# Altium project PCB_tesis.PrjPcb (part 2 of 2)

## Sheet Banks.SchDoc
size A4; SheetNumber: 3; SheetTotal: 5
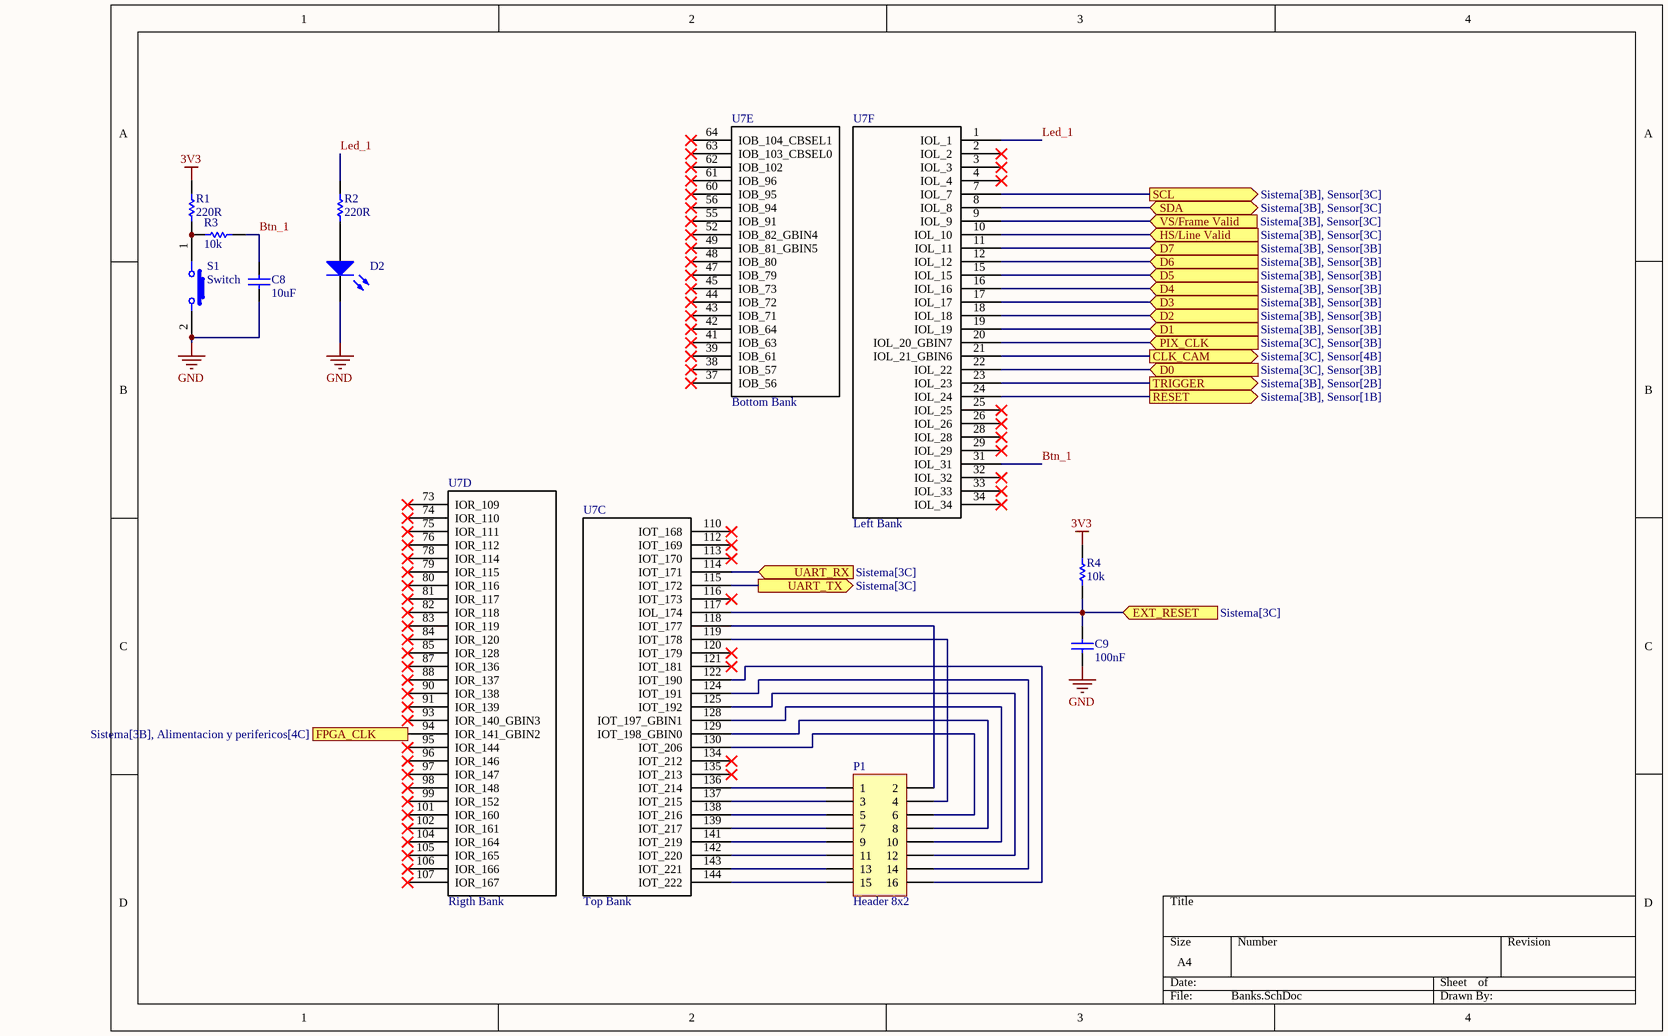
[diagram p3: Banks.SchDoc]

### Parts
C8  10uF  [C_1206_3216_A]
C9  100nF  [C_0805_2013_b]
D2  GREEN  [D_LED_0805_2013]  (value not drawn)
P1  Header 8x2  [P_HDR2X8_3D]
R1  220R  [R_0805_2012_a]
R2  220R  [R_0805_2012_a]
R3  10k  [R_0805_2012_a]
R4  10k  [R_0805_2012_a]
S1  Switch  [S_SMD_SPST-NO]
U7  Top Bank  [U_TQFP-144]  (parts C,D,E,F of 9)

### Ports
CLK_CAM (out, see Sistema[3C], Sensor[4B]), D0 (in, see Sistema[3C], Sensor[3B]), D1 (in, see Sistema[3B], Sensor[3B]), D2 (in, see Sistema[3B], Sensor[3B]), D3 (in, see Sistema[3B], Sensor[3B]), D4 (in, see Sistema[3B], Sensor[3B]), D5 (in, see Sistema[3B], Sensor[3B]), D6 (in, see Sistema[3B], Sensor[3B]), D7 (in, see Sistema[3B], Sensor[3B]), EXT_RESET (in, see Sistema[3C]), FPGA_CLK (in, see Sistema[3B], Alimentacion y perifericos[4C]), HS/Line Valid (in, see Sistema[3B], Sensor[3C]), PIX_CLK (in, see Sistema[3C], Sensor[3B]), RESET (out, see Sistema[3B], Sensor[1B]), SCL (out, see Sistema[3B], Sensor[3C]), SDA (bidir, see Sistema[3B], Sensor[3C]), TRIGGER (out, see Sistema[3B], Sensor[2B]), UART_RX (in, see Sistema[3C]), UART_TX (out, see Sistema[3C]), VS/Frame Valid (in, see Sistema[3B], Sensor[3C])

### Nets
3V3: R1.2 R4.2
GND: C8.1 C9.1 D2.1(K) S1.2
Btn_1: C8.2 R3.2 U7.31(IOL_31)
Led_1: R2.2 U7.1(IOL_1)
NetC9_2: C9.2 R4.1 U7.117(IOL_174) ; port EXT_RESET
NetD2_2: D2.2(A) R2.1
NetP1_1: P1.1 U7.136(IOT_214)
NetP1_2: P1.2 U7.118(IOT_177)
NetP1_3: P1.3 U7.137(IOT_215)
NetP1_4: P1.4 U7.119(IOT_178)
NetP1_5: P1.5 U7.138(IOT_216)
NetP1_6: P1.6 U7.130(IOT_206)
NetP1_7: P1.7 U7.139(IOT_217)
NetP1_8: P1.8 U7.129(IOT_198_GBIN0)
NetP1_9: P1.9 U7.141(IOT_219)
NetP1_10: P1.10 U7.128(IOT_197_GBIN1)
NetP1_11: P1.11 U7.142(IOT_220)
NetP1_12: P1.12 U7.125(IOT_192)
NetP1_13: P1.13 U7.143(IOT_221)
NetP1_14: P1.14 U7.124(IOT_191)
NetP1_15: P1.15 U7.144(IOT_222)
NetP1_16: P1.16 U7.122(IOT_190)
NetP3_A8: U7.115(IOT_172) ; port UART_TX
NetP3_A9: U7.114(IOT_171) ; port UART_RX
NetR1_1: R1.1 R3.1 S1.1
NetR11_1: U7.94(IOR_141_GBIN2) ; port FPGA_CLK
NetU7_7: U7.7(IOL_7) ; port SCL
NetU7_8: U7.8(IOL_8) ; port SDA
NetU7_9: U7.9(IOL_9) ; port VS/Frame Valid
NetU7_10: U7.10(IOL_10) ; port HS/Line Valid
NetU7_11: U7.11(IOL_11) ; port D7
NetU7_12: U7.12(IOL_12) ; port D6
NetU7_15: U7.15(IOL_15) ; port D5
NetU7_16: U7.16(IOL_16) ; port D4
NetU7_17: U7.17(IOL_17) ; port D3
NetU7_18: U7.18(IOL_18) ; port D2
NetU7_19: U7.19(IOL_19) ; port D1
NetU7_20: U7.20(IOL_20_GBIN7) ; port PIX_CLK
NetU7_21: U7.21(IOL_21_GBIN6) ; port CLK_CAM
NetU7_22: U7.22(IOL_22) ; port D0
NetU7_23: U7.23(IOL_23) ; port TRIGGER
NetU7_24: U7.24(IOL_24) ; port RESET

Not connected (* = marked no-connect by the designer): U7 2(IOL_2)* 3(IOL_3)* 4(IOL_4)* 25(IOL_25)* 26(IOL_26)* 28(IOL_28)* 29(IOL_29)* 32(IOL_32)* 33(IOL_33)* 34(IOL_34)* 37(IOB_56)* 38(IOB_57)* 39(IOB_61)* 41(IOB_63)* 42(IOB_64)* 43(IOB_71)* 44(IOB_72)* 45(IOB_73)* 47(IOB_79)* 48(IOB_80)* 49(IOB_81_GBIN5)* 52(IOB_82_GBIN4)* 55(IOB_91)* 56(IOB_94)* 60(IOB_95)* 61(IOB_96)* 62(IOB_102)* 63(IOB_103_CBSEL0)* 64(IOB_104_CBSEL1)* 73(IOR_109)* 74(IOR_110)* 75(IOR_111)* 76(IOR_112)* 78(IOR_114)* 79(IOR_115)* 80(IOR_116)* 81(IOR_117)* 82(IOR_118)* 83(IOR_119)* 84(IOR_120)* 85(IOR_128)* 87(IOR_136)* 88(IOR_137)* 90(IOR_138)* 91(IOR_139)* 93(IOR_140_GBIN3)* 95(IOR_144)* 96(IOR_146)* 97(IOR_147)* 98(IOR_148)* 99(IOR_152)* 101(IOR_160)* 102(IOR_161)* 104(IOR_164)* 105(IOR_165)* 106(IOR_166)* 107(IOR_167)* 110(IOT_168)* 112(IOT_169)* 113(IOT_170)* 116(IOT_173)* 120(IOT_179)* 121(IOT_181)* 134(IOT_212)* 135(IOT_213)*

### Library data of the parts
C8 = C_10uF_25V_c: Capacitor SMD 1206; Manufacturer: Samsung; Manufacturer Part Number: CL31B106KAHNFNE; Tolerance: 10%; Voltage Rating: 25V; Dielectric: X7R; Mounting Technology: Surface Mount; Case/Package: 1206; Case Code (Metric): 3216; Case Code (Imperial): 1206; Min Operating Temperature: -55°C; Max Operating Temperature: 125°C; Packaging: Tape and Reel; Series: CL; Construction: Flat; Length: 3.2mm; Height: 1.6mm; Depth: 1.6mm; Radiation Hardening: No; Lead Free: Lead Free; RoHS Compliant: Yes; ComponentLink1URL: https://datasheet.ciiva.com/25795/cl31b106kahnfne-25795136.pdf?src-supplier=Digikey; ComponentLink1Description: https://datasheet.ciiva.com/25795/cl31b106kahnfne-25795136.pdf?src-supplier=Digikey; Supplier 1: Digikey; Supplier Part Number 1: 1276-3100-1-ND; RoHS: Yes; Category: Ceramic Capacitors; Stock 1: 466532; Pricing 1: 1=0,23, 10=0,149, 50=0,094, 100=0,0752, 500=0,0543, 1000=0,04804 (USD); Value: 10uF
C9 = C_100nF_50V_b: Capacitor SMD 0805; Manufacturer: Yageo; Manufacturer Part Number: CC0805KRX7R9BB104; Material: Ceramic; Tolerance: 10%; Dielectric: X7R; Voltage: 50V; Insulation Resistance: 100GR; Mounting Technology: Surface Mount; Case/Package: 0805; Pins: 2; Case Code (Metric): 2012; Case Code (Imperial): 0805; Min Operating Temperature: -55°C; Max Operating Temperature: 125°C; Packaging: Tape and Reel; Voltage Rating: 50V; Package Quantity: 4000; Termination: SMD/SMT; Series: CC; Length: 2mm; Height: 0.85mm; Depth: 1.25mm; Radiation Hardening: No; RoHS Compliant: Yes; Reach SVHC Compliant: No; Halogen Free: 5694HalogenFree; Lead Free: 5697LeadFree; ComponentLink1URL: https://datasheet.ciiva.com/11786/0900766b80d84f1d-11786009.pdf?src-supplier=Rs; ComponentLink1Description: https://datasheet.ciiva.com/11786/0900766b80d84f1d-11786009.pdf?src-supplier=Rs; ComponentLink2URL: https://datasheet.ciiva.com/46393/1734573-46393307.pdf?src-supplier=Element14; ComponentLink2Description: https://datasheet.ciiva.com/46393/1734573-46393307.pdf?src-supplier=Element14; ComponentLink3URL: https://datasheet.ciiva.com/155/mlccorderingcode-155930.pdf?src-supplier=Digikey; ComponentLink3Description: https://datasheet.ciiva.com/155/mlccorderingcode-155930.pdf?src-supplier=Digikey; ComponentLink4URL: https://datasheet.ciiva.com/155/mlccorderingcode-155929.pdf?src-supplier=Digikey; ComponentLink4Description: https://datasheet.ciiva.com/155/mlccorderingcode-155929.pdf?src-supplier=Digikey; ComponentLink5URL: https://datasheet.ciiva.com/155/mlccorderingcode-155931.pdf?src-supplier=Digikey; ComponentLink5Description: https://datasheet.ciiva.com/155/mlccorderingcode-155931.pdf?src-supplier=Digikey; ComponentLink6URL: https://datasheet.ciiva.com/11464/upy-gphc-x7r-6-3v-to-50v-8-11464757.pdf?src-supplier=Avnet; ComponentLink6Description: https://datasheet.ciiva.com/11464/upy-gphc-x7r-6-3v-to-50v-8-11464757.pdf?src-supplier=Avnet; ComponentLink7URL: https://datasheet.ciiva.com/28450/1489800-28450805.pdf?src-supplier=Element14; ComponentLink7Description: https://datasheet.ciiva.com/28450/1489800-28450805.pdf?src-supplier=Element14; ComponentLink8URL: https://datasheet.ciiva.com/29242/445210-da-01-en-kerko-chip-0805-x7r-0-1uf-10proz-50vg-29242074.pdf?src-supplier=Conrad; ComponentLink8Description: https://datasheet.ciiva.com/29242/445210-da-01-en-kerko-chip-0805-x7r-0-1uf-10proz-50vg-29242074.pdf?src-supplier=Conrad; Supplier 1: Digikey; Supplier Part Number 1: 311-1140-1-ND; RoHS: Yes; Category: Ceramic Capacitors; Stock 1: 5306374; Pricing 1: 1=0,1, 10=0,07, 50=0,0418, 100=0,0329, 500=0,02428, 1000=0,0201 (USD); Value: 100nF
D2 = D_LED_SMD_0805: (Modificar) Diode SMD 0805; Value: GREEN
P1 = P_Conector 8x2: Value: Header 8x2
R1 R2 = R_220R_b: Resistor SMD 0805; Manufacturer: Bourns; Manufacturer Part Number: CR0805-FX-2200ELF; Tolerance: 1%; Power Rating: 125mW; Voltage Rating: 150V; Temperature Coefficient: 100ppm/°C; Mounting Technology: Surface Mount; Case/Package: 0805; Case Code (Metric): 2012; Case Code (Imperial): 0805; Contact Plating: Tin; Min Operating Temperature: -55°C; Max Operating Temperature: 155°C; Package Quantity: 5000; Packaging: Tape and Reel; Number of Terminations: 2; Termination: SMD/SMT; Max Power Dissipation: 125mW; Features: Moisture Resistant; Series: CR0805; Length: 2mm; Width: 1.25mm; Height: 0.5mm; Thickness: 508um; Radiation Hardening: No; RoHS Compliant: Yes; ComponentLink1URL: https://datasheet.ciiva.com/5540/chpreztr-5540846.pdf?src-supplier=Mouser; ComponentLink1Description: https://datasheet.ciiva.com/5540/chpreztr-5540846.pdf?src-supplier=Mouser; Supplier 1: Digikey; Supplier Part Number 1: CR0805-FX-2200ELFCT-ND; RoHS: Yes; Category: Chip SMD Resistors; Stock 1: 162372; Pricing 1: 1=0,1, 10=0,021, 50=0,0132, 100=0,011, 500=0,00744, 1000=0,00639 (USD); Value: 220R
R3 R4 = R_10k_b: Resistor SMD 0805; Manufacturer: Yageo; Manufacturer Part Number: AC0805FR-0710KL; Tolerance: 1%; Power Rating: 125mW; Voltage Rating: 150V; Temperature Coefficient: 100ppm/°C; Case/Package: 0805; Case Code (Metric): 2012; Case Code (Imperial): 0805; Min Operating Temperature: -55°C; Max Operating Temperature: 155°C; Packaging: Tape and Reel; Package Quantity: 1; Number of Terminations: 2; Termination: SMD/SMT; Max Power Dissipation: 125mW; Features: Moisture Resistant,Automotive AEC-Q200,Anti-Sulfur; Series: AC; Construction: Rectangular; Length: 0.079inch; Width: 0.049inch; Height: 0.024inch; Depth: 1.25mm; Military Standard: Not; Lead Free: Lead Free; RoHS Compliant: Yes; ComponentLink1URL: http://www.yageo.com/NewPortal/yageodocoutput?fileName=/pdf/R-Chip/PYu-AC_51_RoHS_L_6.pdf&src-supplier=Digikey; ComponentLink1Description: http://www.yageo.com/NewPortal/yageodocoutput?fileName=/pdf/R-Chip/PYu-AC_51_RoHS_L_6.pdf&src-supplier=Digikey; ComponentLink2URL: http://www.yageo.com/documents/recent/PYu-AC_51_RoHS_L_2_revised.pdf?src-supplier=Future+Electronics; ComponentLink2Description: http://www.yageo.com/documents/recent/PYu-AC_51_RoHS_L_2_revised.pdf?src-supplier=Future+Electronics; ComponentLink3URL: http://www.yageo.com/NewPortal/yageodocoutput?fileName=/pdf/R-Chip/PYu-AC_51_RoHS_L_6.pdf&src-supplier=NAC+Semi; ComponentLink3Description: http://www.yageo.com/NewPortal/yageodocoutput?fileName=/pdf/R-Chip/PYu-AC_51_RoHS_L_6.pdf&src-supplier=NAC+Semi; ComponentLink4URL: http://www.yageo.com/NewPortal/yageodocoutput?fileName=/pdf/R-Chip/PYu-AC_51_RoHS_L_6.pdf&src-supplier=Rutronik; ComponentLink4Description: http://www.yageo.com/NewPortal/yageodocoutput?fileName=/pdf/R-Chip/PYu-AC_51_RoHS_L_6.pdf&src-supplier=Rutronik; Supplier 1: Digikey; Supplier Part Number 1: 311-10KLGCT-ND; RoHS: Yes; Category: Chip SMD Resistors; Stock 1: 480247; Pricing 1: 1=0,1, 10=0,031, 50=0,0198, 100=0,0166, 500=0,01152, 1000=0,00997 (USD); Value: 10k
S1 = S_?_3: (Generico) Switch SMD; Value: Switch
U7 = U_iCE40HX4K: Supplier 1: Digikey; Supplier Part Number 1: 220-1572-ND

## Nets that join several sheets
1V2: Power (C4.1 TP2.1 U2.2 U2.4), Alimentacion y perifericos (14 pins)
3V3: Power (6 pins), Alimentacion y perifericos (39 pins), Banks (R1.2 R4.2)
GND: Power (15 pins), Alimentacion y perifericos (42 pins), Banks (C8.1 C9.1 D2.1 S1.2)
NetC9_2: Sistema (P3.A10), Banks (C9.2 R4.1 U7.117)
NetF1_1: Sistema (P3.A1), Power (F1.1)
NetP3_A8: Sistema (P3.A8), Banks (U7.115)
NetP3_A9: Sistema (P3.A9), Banks (U7.114)
NetR11_1: Alimentacion y perifericos (R11.1), Banks (U7.94)